# Altium schematic sheet 4-Connect.SchDoc
size A4; SheetNumber: 4; SheetTotal: 4
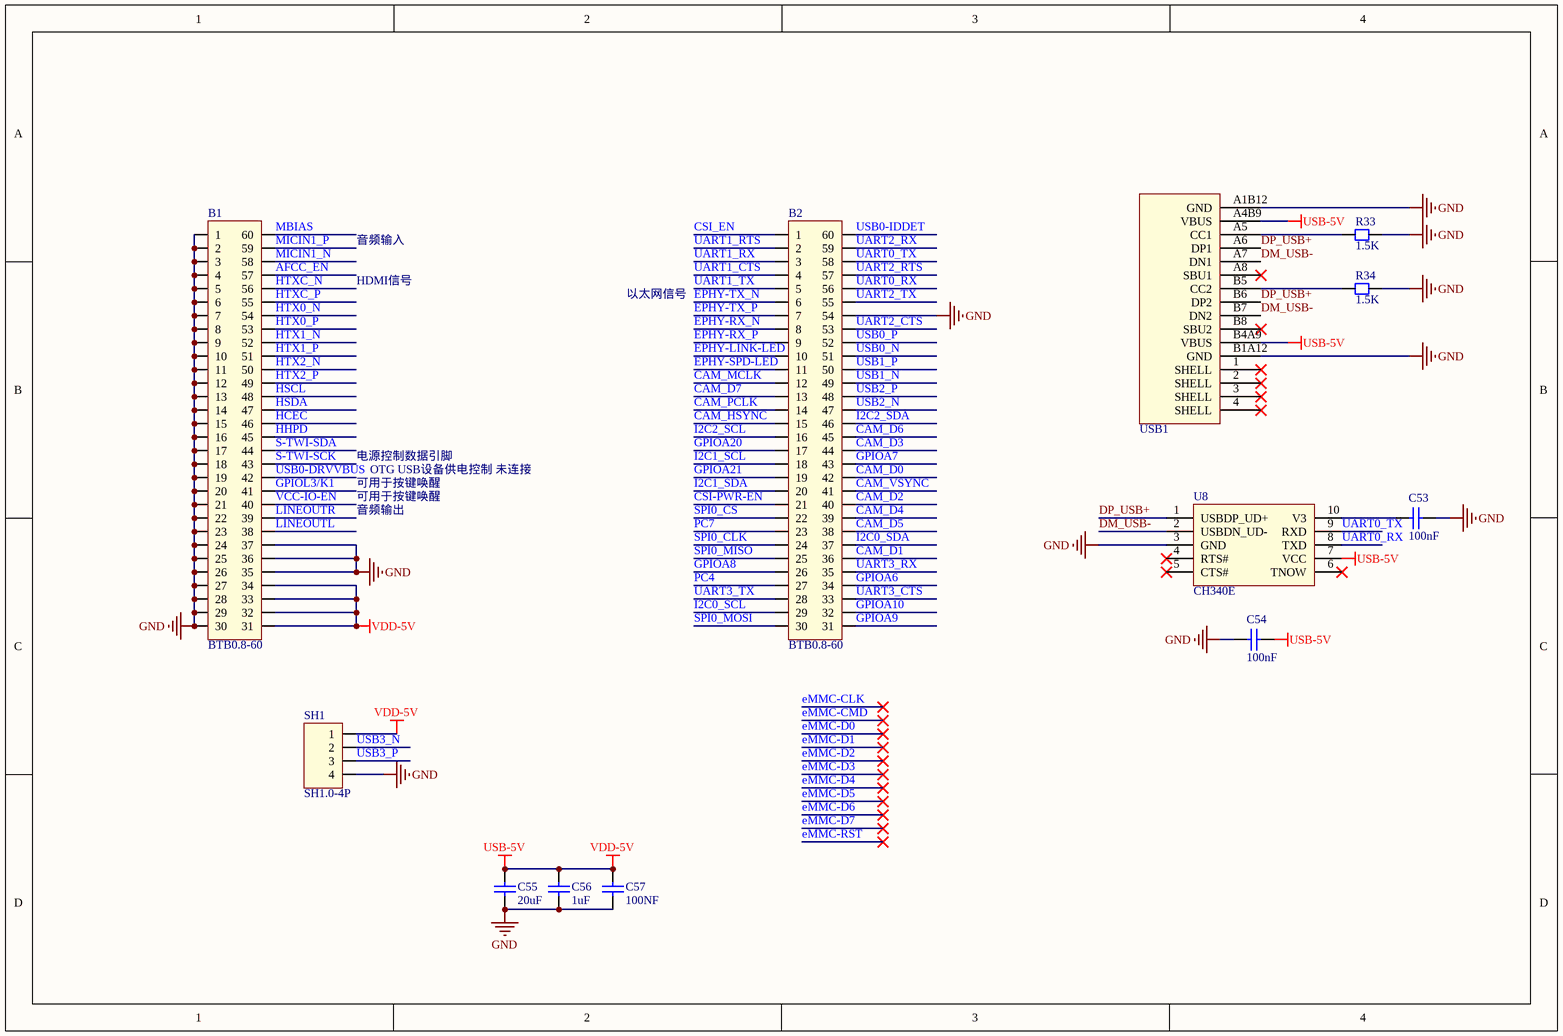
[diagram p0: 4-Connect.SchDoc]

## Parts
B1  BTB0.8-60  [BTB0.8-60-SMD]
B2  BTB0.8-60  [BTB0.8-60-SMD]
C53  100nF  [CC1005-0402]
C54  100nF  [CC1005-0402]
C55  20uF  [CC2012-0805]
C56  1uF  [CC2012-0805]
C57  100NF  [CC2012-0805]
R33  1.5K  [CR1005-0402]
R34  1.5K  [CR1005-0402]
SH1  SH1.0-4P  [SH1.0-4P]
U8  CH340E  [MSOP-10]
USB1  Tpye-c 16P  [TYPE-C 16P]  (value not drawn)

## Nets
GND: B1.1 B1.2 B1.3 B1.4 B1.5 B1.6 B1.7 B1.8 B1.9 B1.10 B1.11 B1.12 B1.13 B1.14 B1.15 B1.16 B1.17 B1.18 B1.19 B1.20 B1.21 B1.22 B1.23 B1.24 B1.25 B1.26 B1.27 B1.28 B1.29 B1.30 B1.35 B1.36 B1.37 B2.54 C53.2 C54.1 C55.1 C56.1 C57.1 R33.1 R34.1 SH1.4 U8.3(GND) USB1.A1B12(GND) USB1.B1A12(GND)
USB-5V: B1.31 B1.32 B1.33 B1.34 C54.2 C55.2 C56.2 C57.2 SH1.1 U8.7(VCC) USB1.A4B9(VBUS) USB1.B4A9(VBUS)  [also labelled VDD-5V]
AFCC_EN: B1.57
CAM_D0: B2.42
CAM_D1: B2.36
CAM_D2: B2.40
CAM_D3: B2.44
CAM_D4: B2.39
CAM_D5: B2.38
CAM_D6: B2.45
CAM_D7: B2.13
CAM_HSYNC: B2.15
CAM_MCLK: B2.12
CAM_PCLK: B2.14
CAM_VSYNC: B2.41
CSI-PWR-EN: B2.21
CSI_EN: B2.1
DM_USB-: U8.2(USBDN_UD-) USB1.A7(DN1) USB1.B7(DN2)
DP_USB+: U8.1(USBDP_UD+) USB1.A6(DP1) USB1.B6(DP2)
EPHY-LINK-LED: B2.10
EPHY-RX_N: B2.8
EPHY-RX_P: B2.9
EPHY-SPD-LED: B2.11
EPHY-TX_N: B2.6
EPHY-TX_P: B2.7
GPIOA6: B2.34
GPIOA7: B2.43
GPIOA8: B2.26
GPIOA9: B2.31
GPIOA10: B2.32
GPIOA20: B2.17
GPIOA21: B2.19
GPIOL3/K1: B1.41
HCEC: B1.46
HHPD: B1.45
HSCL: B1.48
HSDA: B1.47
HTX0_N: B1.54
HTX0_P: B1.53
HTX1_N: B1.52
HTX1_P: B1.51
HTX2_N: B1.50
HTX2_P: B1.49
HTXC_N: B1.56
HTXC_P: B1.55
I2C0_SCL: B2.29
I2C0_SDA: B2.37
I2C1_SCL: B2.18
I2C1_SDA: B2.20
I2C2_SCL: B2.16
I2C2_SDA: B2.46
LINEOUTL: B1.38
LINEOUTR: B1.39
MBIAS: B1.60
MICIN1_N: B1.58
MICIN1_P: B1.59
PC4: B2.27
PC7: B2.23
S-TWI-SCK: B1.43
S-TWI-SDA: B1.44
SPI0_CLK: B2.24
SPI0_CS: B2.22
SPI0_MISO: B2.25
SPI0_MOSI: B2.30
UART0_RX: B2.56 U8.8(TXD)
UART0_TX: B2.58 U8.9(RXD)
UART1_CTS: B2.4
UART1_RTS: B2.2
UART1_RX: B2.3
UART1_TX: B2.5
UART2_CTS: B2.53
UART2_RTS: B2.57
UART2_RX: B2.59
UART2_TX: B2.55
UART3_CTS: B2.33
UART3_RX: B2.35
UART3_TX: B2.28
USB0-DRVVBUS: B1.42
USB0-IDDET: B2.60
USB0_N: B2.51
USB0_P: B2.52
USB1_N: B2.49
USB1_P: B2.50
USB2_N: B2.47
USB2_P: B2.48
USB3_N: SH1.2
USB3_P: SH1.3
VCC-IO-EN: B1.40
NetC53_1: C53.1 U8.10(V3)
NetR33_2: R33.2 USB1.A5(CC1)
NetR34_2: R34.2 USB1.B5(CC2)

Not connected (* = marked no-connect by the designer): U8 4(RTS#)* 5(CTS#)* 6(TNOW)*; USB1 1(SHELL)* 2(SHELL)* 3(SHELL)* 4(SHELL)* A8(SBU1)* B8(SBU2)*

## Notes on the sheet
- 音频输入
- HDMI信号
- 以太网信号
- 电源控制数据引脚
- 可用于按键唤醒
- 音频输出
- OTG USB设备供电控制 未连接

## Library data of the parts
B1 B2 = BTB0.8-60: 板对板连接器 总高度5mm
C53 C54 = Chip capacitor: 贴片电容
C55-C57 = Cap Chip 0805: 0805封装的电容; Published: 8-Jun-2000; Revision: July-2002: Re-released for DXP Platform.; Publisher: Altium Limited
R33 R34 = Chip resistor: 贴片电阻
SH1 = SH1.0-4P: 间距为1mm的端子
U8 = CH340E: usd转串口芯片 MSOP10封装
USB1 = Tpye-c 16P: 16P 封装的TYPE -c接口 4固定插脚 双向